# Altium schematic sheet ST_SYS_Board_FPGA_SUP.schdoc
size 420 x 297 mm; EDA_Number: ARTIQ; Author: G.Kasprowicz; CompanyName: WUT ISE; DrawnBy: G.Kasprowicz; Organization: WUT ISE; DocumentNumber: 10; SheetNumber: 10; ModifiedBy: -; CheckedDate: -; Title2: FPGA supply; Designer: G.Kasprowicz; ModifiedDate: -; ProjectName: Sensor Box
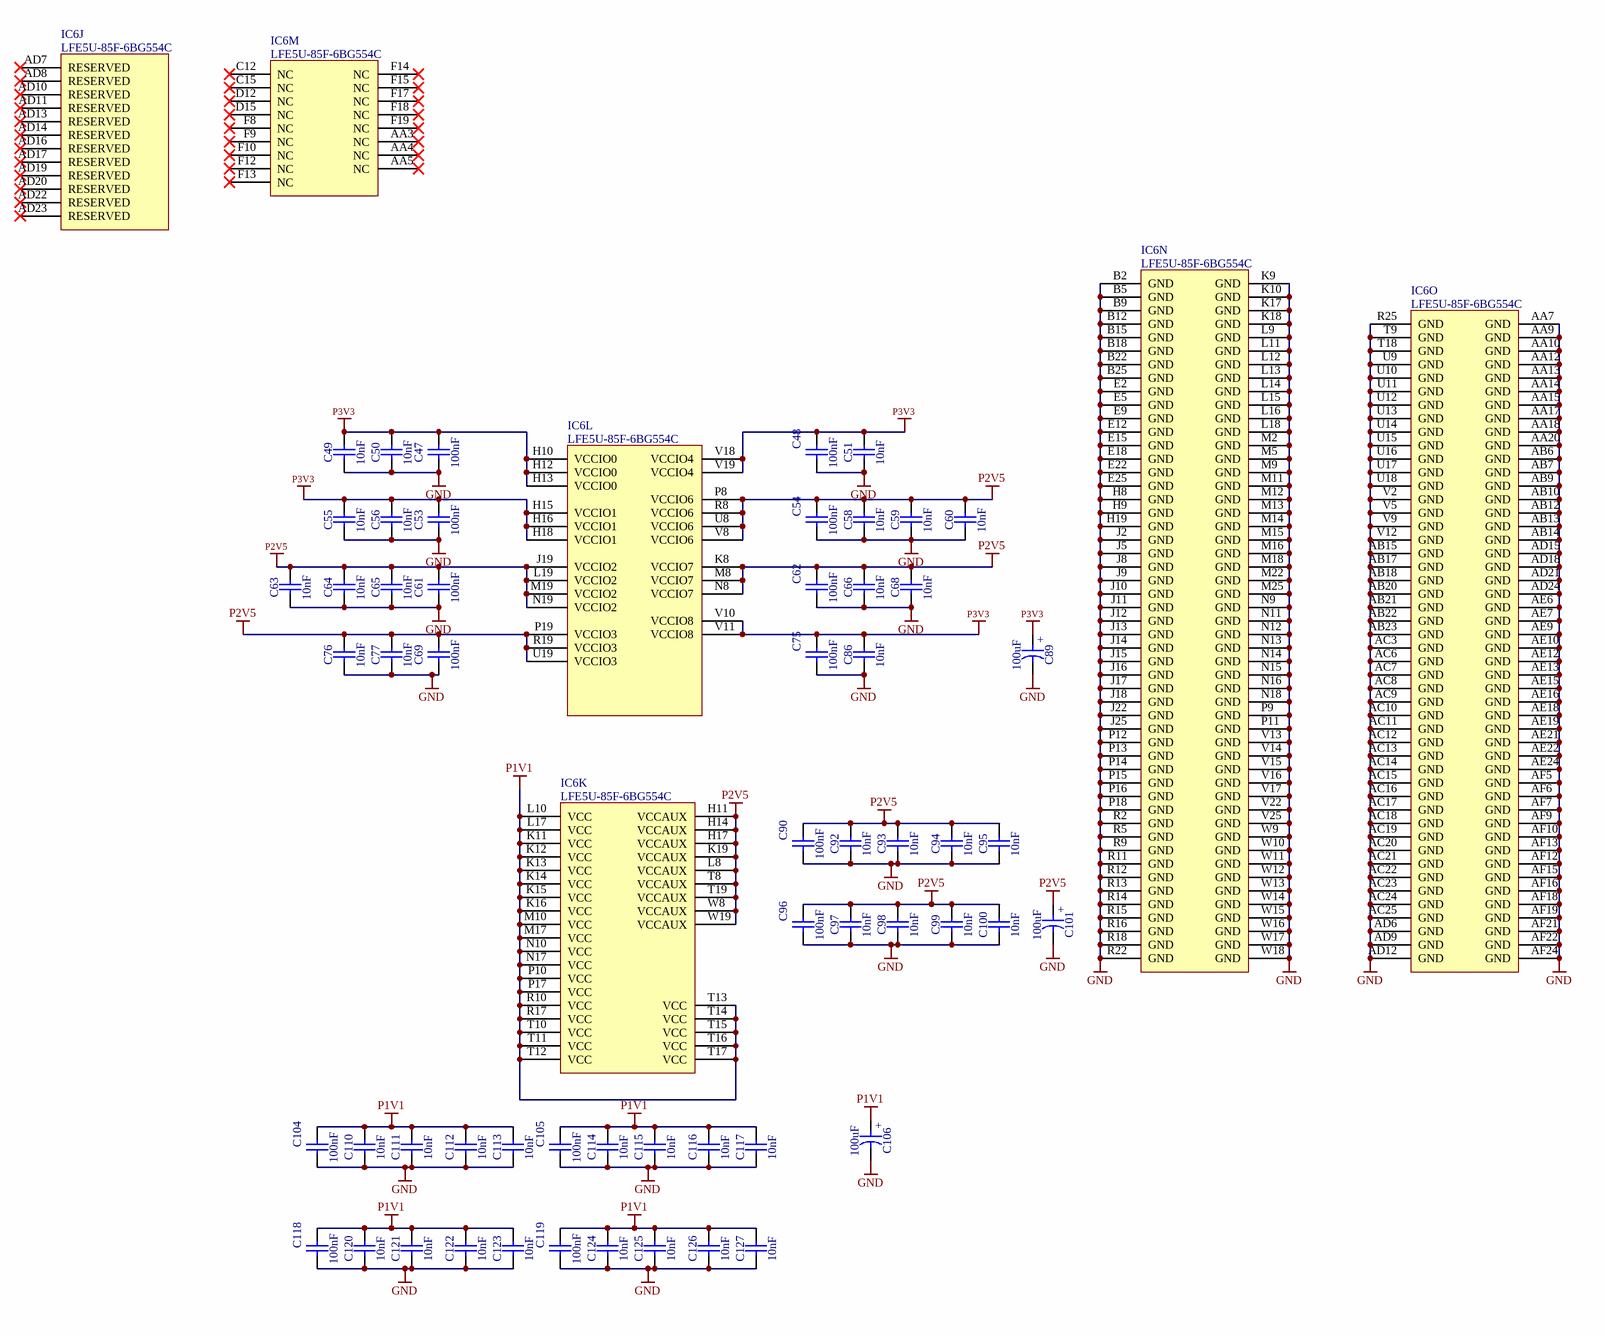
[diagram p0: ST_SYS_Board_FPGA_SUP.schdoc]

## Parts
C47  100nF  [CAPC1005X55N]
C48  100nF  [CAPC1005X55N]
C49  10nF  [CAPC0603X33N]
C50  10nF  [CAPC0603X33N]
C51  10nF  [CAPC0603X33N]
C53  100nF  [CAPC1005X55N]
C54  100nF  [CAPC1005X55N]
C55  10nF  [CAPC0603X33N]
C56  10nF  [CAPC0603X33N]
C58  10nF  [CAPC0603X33N]
C59  10nF  [CAPC0603X33N]
C60  10nF  [CAPC0603X33N]
C61  100nF  [CAPC1005X55N]
C62  100nF  [CAPC1005X55N]
C63  10nF  [CAPC0603X33N]
C64  10nF  [CAPC0603X33N]
C65  10nF  [CAPC0603X33N]
C66  10nF  [CAPC0603X33N]
C68  10nF  [CAPC0603X33N]
C69  100nF  [CAPC1005X55N]
C75  100nF  [CAPC1005X55N]
C76  10nF  [CAPC0603X33N]
C77  10nF  [CAPC0603X33N]
C86  10nF  [CAPC0603X33N]
C89  100uF  [CAPMP3528X210N]
C90  100nF  [CAPC1005X55N]
C92  10nF  [CAPC0603X33N]
C93  10nF  [CAPC0603X33N]
C94  10nF  [CAPC0603X33N]
C95  10nF  [CAPC0603X33N]
C96  100nF  [CAPC1005X55N]
C97  10nF  [CAPC0603X33N]
C98  10nF  [CAPC0603X33N]
C99  10nF  [CAPC0603X33N]
C100  10nF  [CAPC0603X33N]
C101  100uF  [CAPMP3528X210N]
C104  100nF  [CAPC1005X55N]
C105  100nF  [CAPC1005X55N]
C106  100uF  [CAPMP3528X210N]
C110  10nF  [CAPC0603X33N]
C111  10nF  [CAPC0603X33N]
C112  10nF  [CAPC0603X33N]
C113  10nF  [CAPC0603X33N]
C114  10nF  [CAPC0603X33N]
C115  10nF  [CAPC0603X33N]
C116  10nF  [CAPC0603X33N]
C117  10nF  [CAPC0603X33N]
C118  100nF  [CAPC1005X55N]
C119  100nF  [CAPC1005X55N]
C120  10nF  [CAPC0603X33N]
C121  10nF  [CAPC0603X33N]
C122  10nF  [CAPC0603X33N]
C123  10nF  [CAPC0603X33N]
C124  10nF  [CAPC0603X33N]
C125  10nF  [CAPC0603X33N]
C126  10nF  [CAPC0603X33N]
C127  10nF  [CAPC0603X33N]
IC6  LFE5U-85F-6BG554C  [BGA554C80P26X26_2300X2300X176]  (parts J,K,L,M,N,O of 15)

## Nets
GND: C47.1 C48.1 C49.1 C50.1 C51.1 C53.1 C54.1 C55.1 C56.1 C58.1 C59.1 C60.1 C61.1 C62.1 C63.1 C64.1 C65.1 C66.1 C68.1 C69.1 C75.1 C76.1 C77.1 C86.1 C89.2 C90.1 C92.1 C93.1 C94.1 C95.1 C96.1 C97.1 C98.1 C99.1 C100.1 C101.2 C104.1 C105.1 C106.2 C110.1 C111.1 C112.1 C113.1 C114.1 C115.1 C116.1 C117.1 C118.1 C119.1 C120.1 C121.1 C122.1 C123.1 C124.1 C125.1 C126.1 C127.1 IC6.AA7(GND) IC6.AA9(GND) IC6.AA10(GND) IC6.AA12(GND) IC6.AA13(GND) IC6.AA14(GND) IC6.AA15(GND) IC6.AA17(GND) IC6.AA18(GND) IC6.AA20(GND) IC6.AB6(GND) IC6.AB7(GND) IC6.AB9(GND) IC6.AB10(GND) IC6.AB12(GND) IC6.AB13(GND) IC6.AB14(GND) IC6.AB15(GND) IC6.AB17(GND) IC6.AB18(GND) IC6.AB20(GND) IC6.AB21(GND) IC6.AB22(GND) IC6.AB23(GND) IC6.AC3(GND) IC6.AC6(GND) IC6.AC7(GND) IC6.AC8(GND) IC6.AC9(GND) IC6.AC10(GND) IC6.AC11(GND) IC6.AC12(GND) IC6.AC13(GND) IC6.AC14(GND) IC6.AC15(GND) IC6.AC16(GND) IC6.AC17(GND) IC6.AC18(GND) IC6.AC19(GND) IC6.AC20(GND) IC6.AC21(GND) IC6.AC22(GND) IC6.AC23(GND) IC6.AC24(GND) IC6.AC25(GND) IC6.AD6(GND) IC6.AD9(GND) IC6.AD12(GND) IC6.AD15(GND) IC6.AD18(GND) IC6.AD21(GND) IC6.AD24(GND) IC6.AE6(GND) IC6.AE7(GND) IC6.AE9(GND) IC6.AE10(GND) IC6.AE12(GND) IC6.AE13(GND) IC6.AE15(GND) IC6.AE16(GND) IC6.AE18(GND) IC6.AE19(GND) IC6.AE21(GND) IC6.AE22(GND) IC6.AE24(GND) IC6.AF5(GND) IC6.AF6(GND) IC6.AF7(GND) IC6.AF9(GND) IC6.AF10(GND) IC6.AF12(GND) IC6.AF13(GND) IC6.AF15(GND) IC6.AF16(GND) IC6.AF18(GND) IC6.AF19(GND) IC6.AF21(GND) IC6.AF22(GND) IC6.AF24(GND) IC6.B2(GND) IC6.B5(GND) IC6.B9(GND) IC6.B12(GND) IC6.B15(GND) IC6.B18(GND) IC6.B22(GND) IC6.B25(GND) IC6.E2(GND) IC6.E5(GND) IC6.E9(GND) IC6.E12(GND) IC6.E15(GND) IC6.E18(GND) IC6.E22(GND) IC6.E25(GND) IC6.H8(GND) IC6.H9(GND) IC6.H19(GND) IC6.J2(GND) IC6.J5(GND) IC6.J8(GND) IC6.J9(GND) IC6.J10(GND) IC6.J11(GND) IC6.J12(GND) IC6.J13(GND) IC6.J14(GND) IC6.J15(GND) IC6.J16(GND) IC6.J17(GND) IC6.J18(GND) IC6.J22(GND) IC6.J25(GND) IC6.K9(GND) IC6.K10(GND) IC6.K17(GND) IC6.K18(GND) IC6.L9(GND) IC6.L11(GND) IC6.L12(GND) IC6.L13(GND) IC6.L14(GND) IC6.L15(GND) IC6.L16(GND) IC6.L18(GND) IC6.M2(GND) IC6.M5(GND) IC6.M9(GND) IC6.M11(GND) IC6.M12(GND) IC6.M13(GND) IC6.M14(GND) IC6.M15(GND) IC6.M16(GND) IC6.M18(GND) IC6.M22(GND) IC6.M25(GND) IC6.N9(GND) IC6.N11(GND) IC6.N12(GND) IC6.N13(GND) IC6.N14(GND) IC6.N15(GND) IC6.N16(GND) IC6.N18(GND) IC6.P9(GND) IC6.P11(GND) IC6.P12(GND) IC6.P13(GND) IC6.P14(GND) IC6.P15(GND) IC6.P16(GND) IC6.P18(GND) IC6.R2(GND) IC6.R5(GND) IC6.R9(GND) IC6.R11(GND) IC6.R12(GND) IC6.R13(GND) IC6.R14(GND) IC6.R15(GND) IC6.R16(GND) IC6.R18(GND) IC6.R22(GND) IC6.R25(GND) IC6.T9(GND) IC6.T18(GND) IC6.U9(GND) IC6.U10(GND) IC6.U11(GND) IC6.U12(GND) IC6.U13(GND) IC6.U14(GND) IC6.U15(GND) IC6.U16(GND) IC6.U17(GND) IC6.U18(GND) IC6.V2(GND) IC6.V5(GND) IC6.V9(GND) IC6.V12(GND) IC6.V13(GND) IC6.V14(GND) IC6.V15(GND) IC6.V16(GND) IC6.V17(GND) IC6.V22(GND) IC6.V25(GND) IC6.W9(GND) IC6.W10(GND) IC6.W11(GND) IC6.W12(GND) IC6.W13(GND) IC6.W14(GND) IC6.W15(GND) IC6.W16(GND) IC6.W17(GND) IC6.W18(GND)
P1V1: C104.2 C105.2 C106.1 C110.2 C111.2 C112.2 C113.2 C114.2 C115.2 C116.2 C117.2 C118.2 C119.2 C120.2 C121.2 C122.2 C123.2 C124.2 C125.2 C126.2 C127.2 IC6.K11(VCC) IC6.K12(VCC) IC6.K13(VCC) IC6.K14(VCC) IC6.K15(VCC) IC6.K16(VCC) IC6.L10(VCC) IC6.L17(VCC) IC6.M10(VCC) IC6.M17(VCC) IC6.N10(VCC) IC6.N17(VCC) IC6.P10(VCC) IC6.P17(VCC) IC6.R10(VCC) IC6.R17(VCC) IC6.T10(VCC) IC6.T11(VCC) IC6.T12(VCC) IC6.T13(VCC) IC6.T14(VCC) IC6.T15(VCC) IC6.T16(VCC) IC6.T17(VCC)
P2V5: C54.2 C58.2 C59.2 C60.2 C61.2 C62.2 C63.2 C64.2 C65.2 C66.2 C68.2 C69.2 C76.2 C77.2 C90.2 C92.2 C93.2 C94.2 C95.2 C96.2 C97.2 C98.2 C99.2 C100.2 C101.1 IC6.H11(VCCAUX) IC6.H14(VCCAUX) IC6.H17(VCCAUX) IC6.J19(VCCIO2) IC6.K8(VCCIO7) IC6.K19(VCCAUX) IC6.L8(VCCAUX) IC6.L19(VCCIO2) IC6.M8(VCCIO7) IC6.M19(VCCIO2) IC6.N8(VCCIO7) IC6.N19(VCCIO2) IC6.P8(VCCIO6) IC6.P19(VCCIO3) IC6.R8(VCCIO6) IC6.R19(VCCIO3) IC6.T8(VCCAUX) IC6.T19(VCCAUX) IC6.U8(VCCIO6) IC6.U19(VCCIO3) IC6.V8(VCCIO6) IC6.W8(VCCAUX) IC6.W19(VCCAUX)
P3V3: C47.2 C48.2 C49.2 C50.2 C51.2 C53.2 C55.2 C56.2 C75.2 C86.2 C89.1 IC6.H10(VCCIO0) IC6.H12(VCCIO0) IC6.H13(VCCIO0) IC6.H15(VCCIO1) IC6.H16(VCCIO1) IC6.H18(VCCIO1) IC6.V10(VCCIO8) IC6.V11(VCCIO8) IC6.V18(VCCIO4) IC6.V19(VCCIO4)

Not connected (* = marked no-connect by the designer): IC6 AA3(NC)* AA4(NC)* AA5(NC)* AD7(RESERVED)* AD8(RESERVED)* AD10(RESERVED)* AD11(RESERVED)* AD13(RESERVED)* AD14(RESERVED)* AD16(RESERVED)* AD17(RESERVED)* AD19(RESERVED)* AD20(RESERVED)* AD22(RESERVED)* AD23(RESERVED)* C12(NC)* C15(NC)* D12(NC)* D15(NC)* F8(NC)* F9(NC)* F10(NC)* F12(NC)* F13(NC)* F14(NC)* F15(NC)* F17(NC)* F18(NC)* F19(NC)*

## Notes on the sheet
- Project/Equipment
- Document
- Designer
- Drawn by
- Check.by
- Copyright WUT =Copy(CurrentDate,7,4)
  This document describes Open Hardware and is licensed under the CERN-OHL-W v2
  You may redistribute and modify this documentation and make products using it under the terms of the CERN-OHL-W v2 (https:/cern.ch/cern-ohl). This documentation is distributed WITHOUT ANY EXPRESS OR IMPLIED WARRANTY, INCLUDING OF MERCHANTABILITY, SATISFACTORY QUALITY AND FITNESS FOR A PARTICULAR PURPOSE. Please see the CERN-OHL-W v2 for applicable conditions.
  Source location: =SourceLocation
  As per CERN-OHL-W v2 section 4, should You produce hardware based on these sources, You must maintain the Source Location visible on the silkscreen or top copper for a =Title1 PCB or other product you make using this documentation.
- Contact:
- File
- Last Mod.
- Print Date
- Sheet
- Size
- A3
- of
- Rev
- (in symbol CTE3528-21_100UF_6.3V_20%_LESR015_KEMET_T520) +

## Library data of the parts
C47 C48 C53 C54 C61 C62 C69 C75 C90 C96 C104 C105 C118 C119 = CC0402_100NF_16V_10%_X5R: Non-polarised capacitor; Part Description: SMD Multilayer Chip Ceramic Capacitor; Manufacturer: GENERIC; Manufacturer1 Part Number: GRM155R61C104KA88D; Voltage: 16V; TC: X5R; Tolerance: ±10%; Part Number: CC0402_100NF_16V_10%_X5R; Component Kind: Standard; Component Type: Standard; Pin Count: 2; Value: 100nF; Status: None; Manufacturer Part Number: CC0402_100NF_16V_10%_X5R; Case: 0402; Mounted: Yes; Socket: No; SMD: Yes; Sense: No; Manufacturer1 Example: MURATA; Manufacturer1 ComponentHeight: 0.55mm; HelpURL: \\cern.ch\dfs\Applications\Altium\Datasheets\CC0402_X5R_MURATA_GRM.pdf; Author: CERN DEM JLC; CreateDate: 10.12.2013; LatestRevisionDate: 10.12.2013
C49-C51 C55 C56 C58-C60 C63-C66 C68 C76 C77 C86 C92-C95 C97-C100 C110-C117 C120-C127 = CC0201_10NF_10V_10%_X5R: Non-polarised capacitor; Part Description: SMD Multilayer Chip Ceramic Capacitor; Manufacturer: GENERIC; Manufacturer1 Part Number: 0201ZD103KAT2A; Voltage: 10V; TC: X5R; Tolerance: ±10%; Part Number: CC0201_10NF_10V_10%_X5R; Component Kind: Standard; Component Type: Standard; Pin Count: 2; Value: 10nF; Status: Not Recommended; Manufacturer Part Number: CC0201_10NF_10V_10%_X5R; Case: 0201; Mounted: Yes; Socket: No; SMD: Yes; Sense: No; Manufacturer1 Example: AVX; Manufacturer1 ComponentHeight: 0.33mm; HelpURL: \\cern.ch\dfs\Applications\Altium\Datasheets\CC0201_X5R_AVX.pdf; Author: CERN DEM JLC; CreateDate: 03.12.2007; LatestRevisionDate: 03.12.2007
C89 C101 C106 = CTE3528-21_100UF_6.3V_20%_LESR015_KEMET_T520: Polarised capacitor; Part Description: Low ESR 0R015 Tantalum Chip Capacitor; Manufacturer: KEMET; Manufacturer Part Number: T520B107M006ATE015; Voltage: 6.3V; Tolerance: ±20%; Part Number: CTE3528-21_100UF_6.3V_20%_LESR015_KEMET_T520; Component Kind: Standard; Component Type: Standard; Pin Count: 2; Value: 100uF; Status: None; Case: B; Mounted: Yes; Socket: No; SMD: Yes; Sense: No; ComponentHeight: 2.1mm; HelpURL: \\cern.ch\dfs\Applications\Altium\Datasheets\CTE-LESR_KEMET_T520.pdf; Author: CERN DEM BC; CreateDate: 31.01.2022; LatestRevisionDate: 31.01.2022
IC6 = LFE5U-85F-6BG554C: Part Description: FPGA LatticeECP5 Family 84000 Cells 40nm Technology 1.1V 554-Pin CABGA Tray; Manufacturer: LATTICE SEMICONDUCTOR; PressFit: No; Bonding: No; Part Number: LFE5U-85F-6BG554C; Component Kind: Standard; Component Type: Standard; Device: LFE5U-85F-6BG554C; PackageDescription: BGA, 0.80mm Pitch, Square; 554Pin, 26 Columns X 26 Rows, 23mm X 23mm X 1.76mm H; Manufacturer Part Number: LFE5U-85F-6BG554C; Pin Count: 554; Case: BGA554; Mounted: Yes; Socket: No; SMD: Yes; Sense: No; ComponentHeight: 1.76mm; HelpURL: \\cern.ch\dfs\Applications\Altium\Datasheets\LFE5U-85F-6BG554C.pdf; ComponentLink1URL: \\cern.ch\dfs\Applications\Altium\Datasheets\LATTICE_Package.pdf; ComponentLink1Description: Package Drawing; ComponentLink2URL: \\cern.ch\dfs\Applications\Altium\Datasheets\LFE5U-85F-6BG554C_Pinout.pdf; ComponentLink2Description: Pinout; Author: CERN DEM HF; CreateDate: 18.02.2022; LatestRevisionDate: 18.02.2022